# EAGLE design SPv0 (EAGLE 6.5.0)

## Sheet 1 of 2
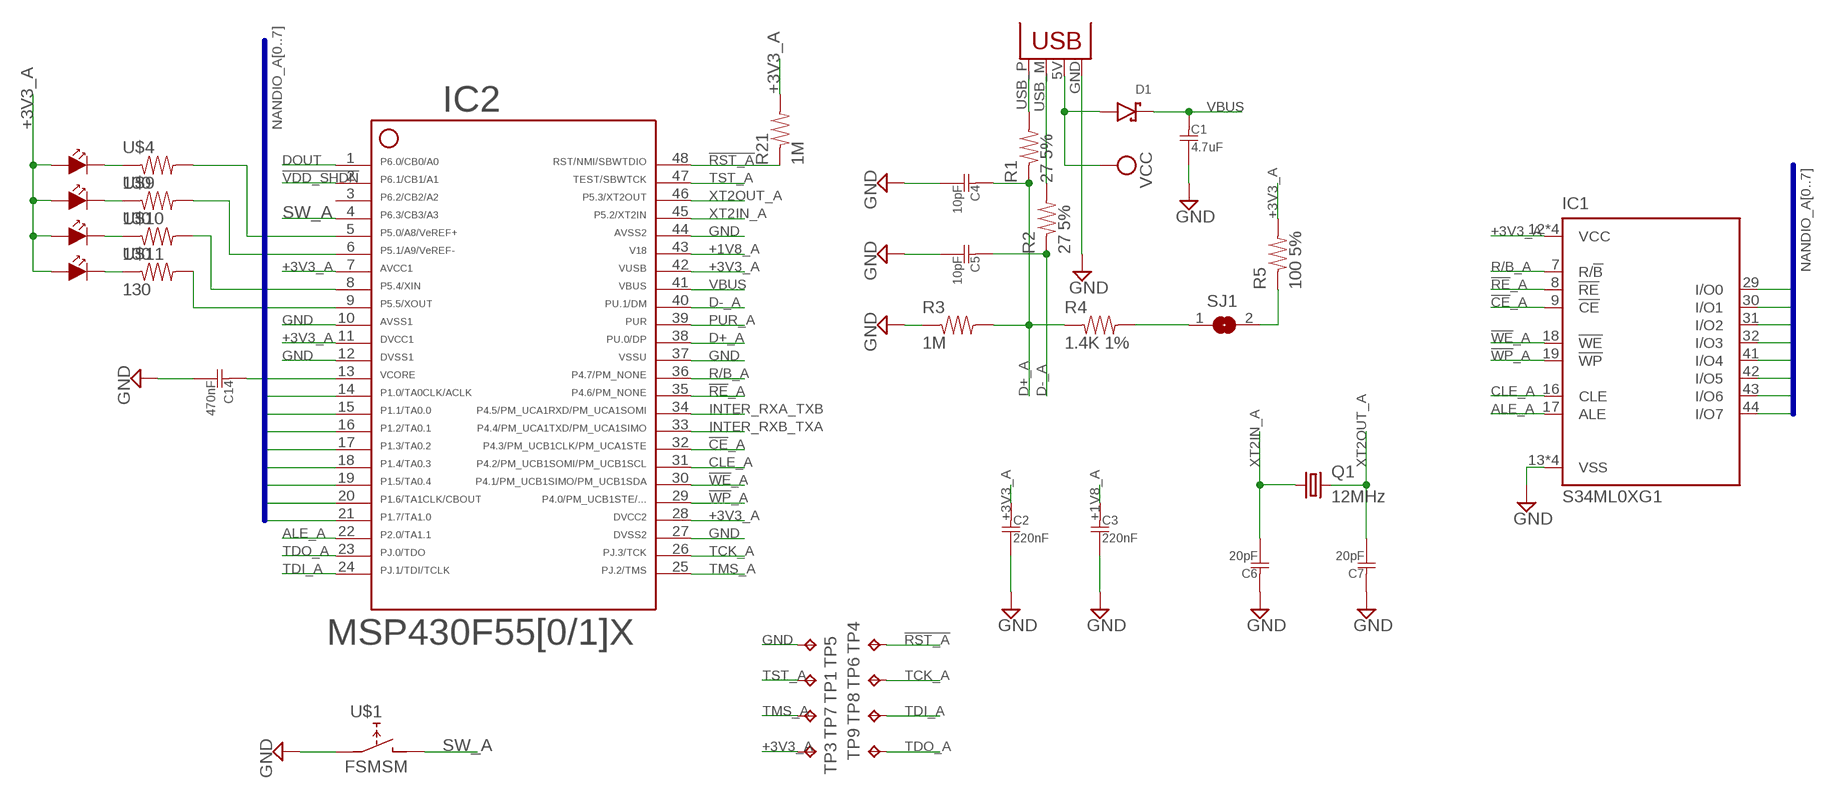
[diagram p0: schematic, sheet 1]

### Parts
C1  4.7uF  C0805  [R0805]
C2  220nF  C0805  [R0805]
C3  220nF  C0805  [R0805]
C4  10pF  C0805  [R0805]
C5  10pF  C0805  [R0805]
C6  20pF  C0805  [R0805]
C7  20pF  C0805  [R0805]
C14  470nF  C0805  [R0805]
D1  D-SCHOTTKY  [SOD123]
IC1  S34ML0XG1  [TSOP48]
IC2  F55[0/1]X---PT48  [PT48]
JP1  USBPCB  [USB-A-PCB]
Q1  12MHz  CRYSTALCSM-3X  [CSM-3X]
R1  27 5%  R0805  [R0805]
R2  27 5%  R0805  [R0805]
R3  1M  R0805  [R0805]
R4  1.4K 1%  R0805  [R0805]
R5  100 5%  R0805  [R0805]
R21  1M  R0805  [R0805]
SJ1  SJW  [SJW]
TP1  TPTP08SQ  [TP08SQ]
TP3  TPTP08SQ  [TP08SQ]
TP4  TPTP08SQ  [TP08SQ]
TP5  TPTP08SQ  [TP08SQ]
TP6  TPTP08SQ  [TP08SQ]
TP7  TPTP08SQ  [TP08SQ]
TP8  TPTP08SQ  [TP08SQ]
TP9  TPTP08SQ  [TP08SQ]
U$1  FSMSM  [FSMSM]
U$4  130  R0805  [R0805]
U$5  LED  [LED0805]
U$6  LED  [LED0805]
U$7  LED  [LED0805]
U$8  LED  [LED0805]
U$9  130  R0805  [R0805]
U$10  130  R0805  [R0805]
U$11  130  R0805  [R0805]

### Nets
!CE!_A: IC1.9(!CE) IC2.32
!RE!_A: IC1.8(!RE) IC2.35
!RST_A!: IC2.48 R21.P$1 TP4.TP
!VDD_SHDN!: IC2.2
!WE!_A: IC1.18(!WE) IC2.30
!WP!_A: IC1.19(!WP) IC2.29
+1V8_A: C3.P$1 IC2.43
+3V3_A: C2.P$1 IC1.12(VCC) IC1.34(VCC) IC1.37(VCC) IC1.39(VCC) IC2.7 IC2.11 IC2.28 IC2.42 R5.P$2 R21.P$2 TP3.TP U$5.ANODE U$6.ANODE U$7.ANODE U$8.ANODE
ALE_A: IC1.17(ALE) IC2.22
CLE_A: IC1.16(CLE) IC2.31
D+_A: C4.P$1 IC2.38 R1.P$1 R3.P$2 R4.P$1
D-_A: C5.P$1 IC2.40 R2.P$1
DOUT: IC2.1 ; also sheet 2
GND: C1.P$2 C2.P$2 C3.P$2 C4.P$2 C5.P$2 C6.P$1 C7.P$1 C14.P$2 IC1.13(VSS) IC1.25(VSS) IC1.36(VSS) IC1.48(VSS) IC2.10 IC2.12 IC2.27 IC2.37 IC2.44 JP1.GND R3.P$1 TP5.TP U$1.P$1(A1) ; also sheet 2
INTER_RXA_TXB: IC2.34
INTER_RXB_TXA: IC2.33
N$1: JP1.USB_P(D+) R1.P$2
N$2: JP1.USB_M(D-) R2.P$2
N$3: C14.P$1 IC2.13
N$4: R5.P$1 SJ1.2
N$11: R4.P$2 SJ1.1
N$19: IC2.9 U$11.P$2
N$22: U$7.CATHODE U$10.P$1
N$23: U$6.CATHODE U$9.P$1
N$24: U$4.P$1 U$5.CATHODE
N$25: U$8.CATHODE U$11.P$1
N$26: IC2.8 U$10.P$2
N$27: IC2.6 U$9.P$2
N$28: IC2.5 U$4.P$2
NANDIO_A0: IC1.29(I/O0) IC2.14
NANDIO_A1: IC1.30(I/O1) IC2.15
NANDIO_A2: IC1.31(I/O2) IC2.16
NANDIO_A3: IC1.32(I/O3) IC2.17
NANDIO_A4: IC1.41(I/O4) IC2.18
NANDIO_A5: IC1.42(I/O5) IC2.19
NANDIO_A6: IC1.43(I/O6) IC2.20
NANDIO_A7: IC1.44(I/O7) IC2.21
PUR_A: IC2.39
R/B_A: IC1.7(R/!B) IC2.36
SW_A: IC2.4 U$1.P$2(B)
TCK_A: IC2.26 TP6.TP
TDI_A: IC2.24 TP8.TP
TDO_A: IC2.23 TP9.TP
TMS_A: IC2.25 TP7.TP
TST_A: IC2.47 TP1.TP
VBUS: C1.P$1 D1.CATHODE IC2.41
VCC: D1.ANODE JP1.5V(VBUS) ; also sheet 2
XT2IN_A: C6.P$2 IC2.45 Q1.P$1
XT2OUT_A: C7.P$2 IC2.46 Q1.P$2
Unconnected: IC2.3

### Buses
NANDIO_A[0..7]

## Sheet 2 of 2
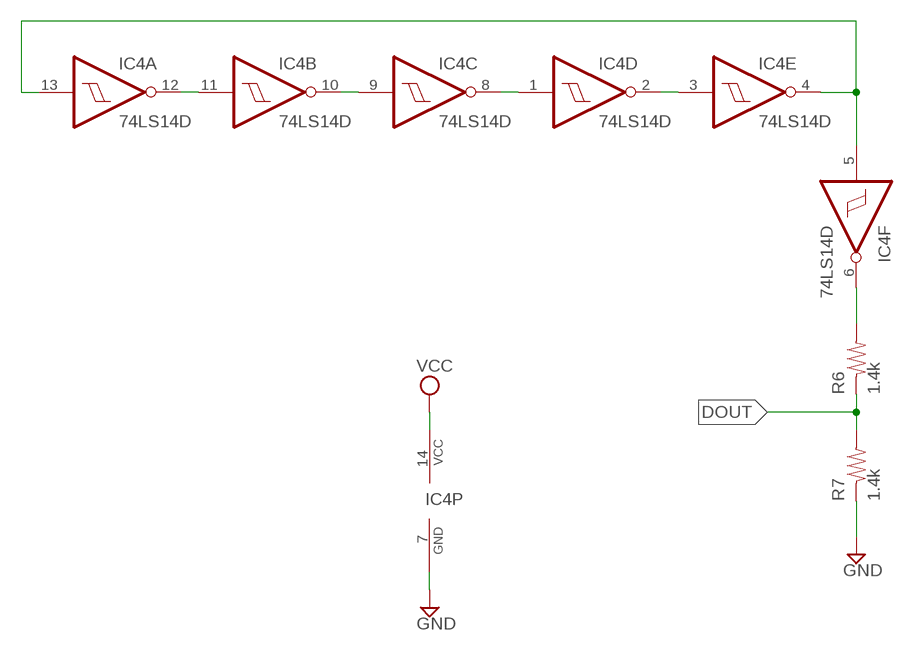
[diagram p1: schematic, sheet 2]

### Parts
IC4  74LS14D  [SO14]
R6  1.4k  R0805  [R0805]
R7  1.4k  R0805  [R0805]

### Nets
DOUT: R6.P$1 R7.P$2 ; also sheet 1
GND: IC4.7(P:GND) R7.P$1 ; also sheet 1
N$5: IC4.11(B:I) IC4.12(A:O)
N$6: IC4.9(C:I) IC4.10(B:O)
N$7: IC4.1(D:I) IC4.8(C:O)
N$8: IC4.2(D:O) IC4.3(E:I)
N$9: IC4.4(E:O) IC4.5(F:I) IC4.13(A:I)
N$10: IC4.6(F:O) R6.P$2
VCC: IC4.14(P:VCC) ; also sheet 1

## Library data of the parts
C1-C7 C14 = Passives:C
D1 = Passives:D-SCHOTTKY
IC1 = Flash:S34ML0XG1: Spansion 1GB, 2GB, and 4GB x8 NAND Flash Memory In x8 I/O mode
IC2 = TI_MSP430_v16:F55[0/1]X---PT48: ***F55[0/1/2]X*** PT48 Rev. 1.0 06/2010 "http://www.ti.com/lit/gpn/msp430f5509" Only for FF5504, F5508,F5509,F5510
IC4 = 74xx-us:74*14: Hex schmitt trigger INVERTER
JP1 = SparkFun-Connectors:USB: USB Connectors USB-B-PTH is fully proven SKU : PRT-00139/CONN-08278 USB-miniB is fully proven SKU : PRT-00587 USB-A-PCB is untested. USB-A-H is throughly reviewed, but untested. Spark Fun Electronics SKU : PRT-00437 USB-B-SMT is throughly reviewed, but untested. Needs silkscreen touching up. USB-A-S has not been used/tested USB-MB-H has not been used/tested USB-MICROB has been used. CONN-09505
Q1 = Passives:CRYSTAL: CRYSTAL
R1-R7 R21 U$4 U$9-U$11 = Passives:R: A standard resistor.
SJ1 = jumper:SJ: SMD solder JUMPER
TP1 TP3-TP9 = testpad:TP: Test pad
U$1 = Passives:FSMSM
U$5-U$8 = Passives:LED

## Board
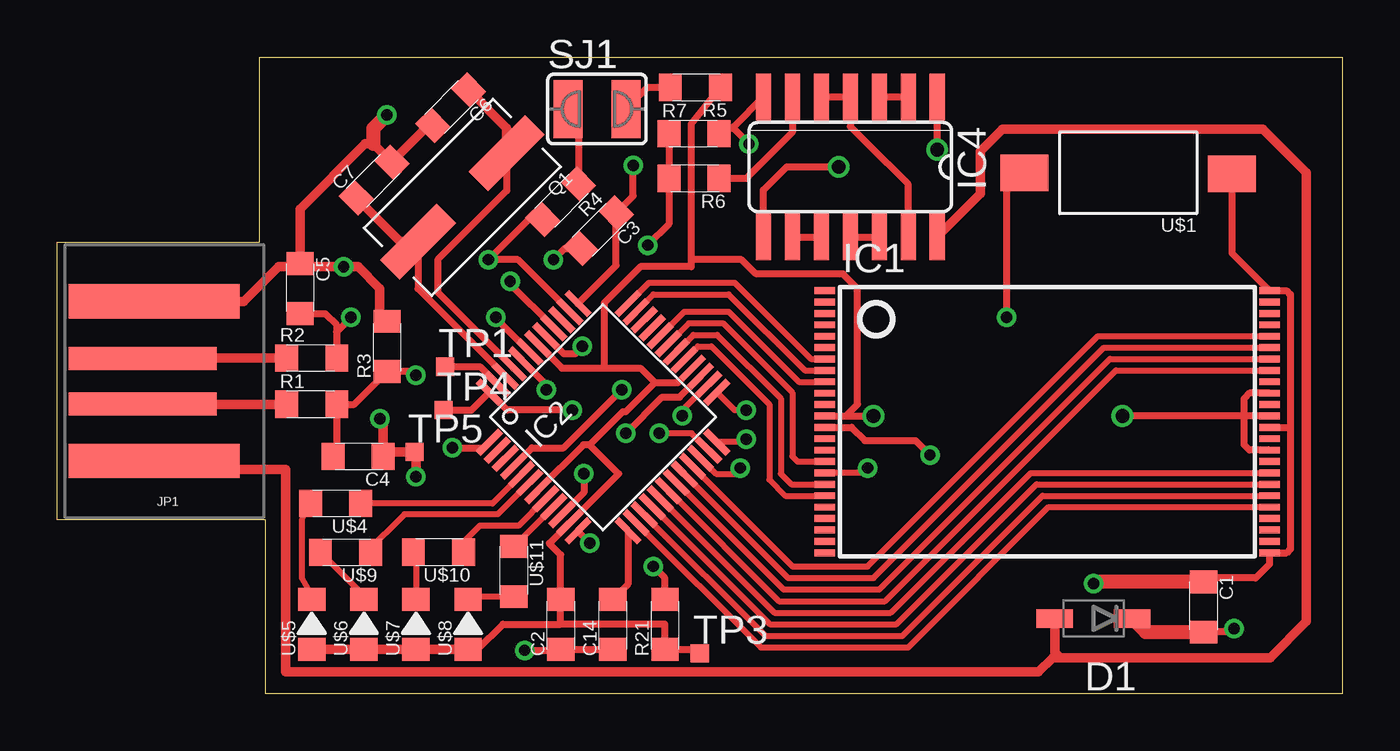
[diagram p2: board, top side]
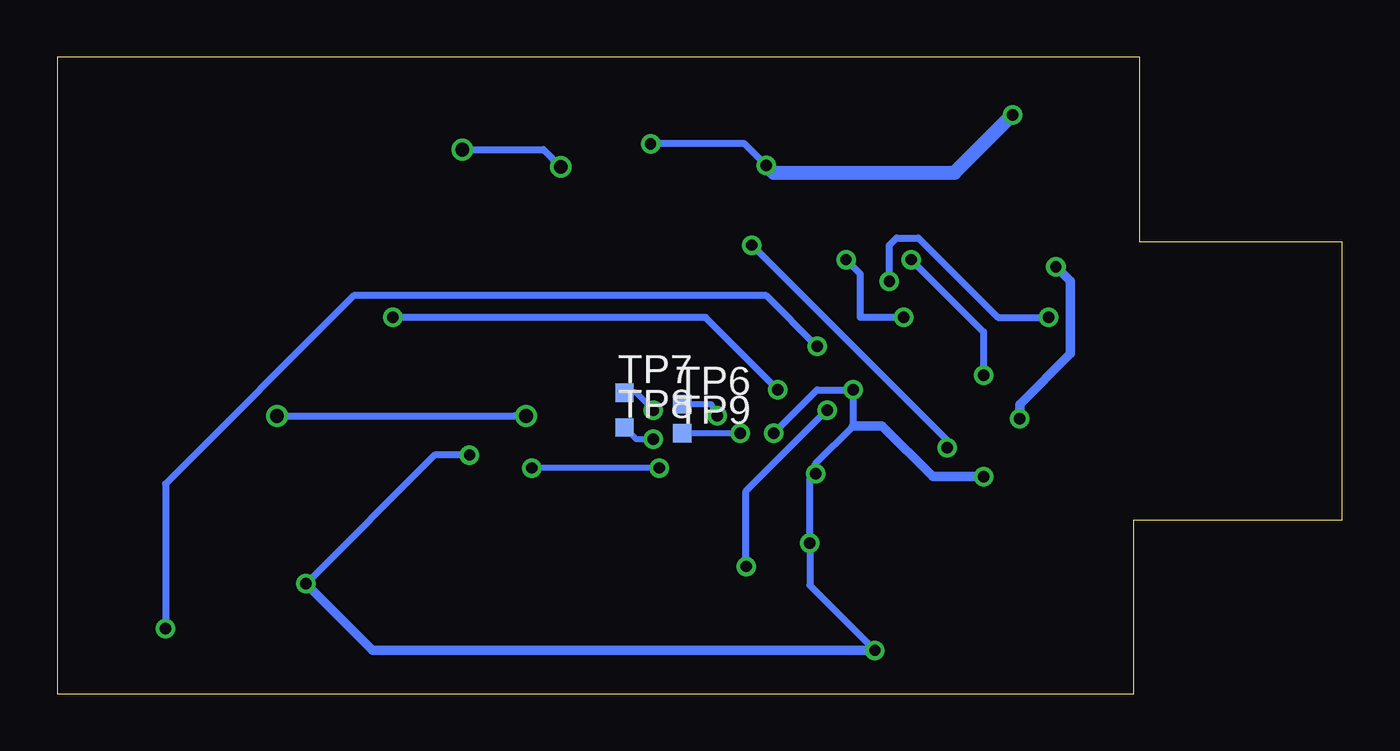
[diagram p3: board, bottom side, seen from below]

Size 56.39 x 27.94 mm. Coordinates in mm from the lower left corner, seen from the top.
Outline: 8.89,19.81 8.89,27.94 56.39,27.94 56.39,0 9.14,0 9.14,7.62 0,7.62 0,19.81 8.89,19.81
Copper layers (1*16): Top 0.0356mm / dielectric 1.5011mm / Bottom 0.0356mm
Design rules "LaenPCBOrder": minimum track width 6mil, minimum drill 13mil, track to track 6mil, track to pad 6mil, pad to pad 6mil, via to via 6mil, smd to smd 6mil, copper to edge 15mil, drill to drill 6mil, minimum pad ring 7mil, minimum via ring 7mil, stop-mask expansion 3mil, vias tented up to drill 0mil, thermal gap 10mil

### Footprints (pad centres in the part's own frame; a part is rotated, then mirrored left to right if it is on the bottom)
R0805 = smd 1 x 1.2: P$1 1.1,0; P$2 -1.1,0
SOD123 = smd 1.6 x 0.8: ANODE 1.7,0; CATHODE -1.7,0
TSOP48 = smd 0.9 x 0.3: 1 -9.75,5.75; 2 -9.75,5.25; 3 -9.75,4.75; 4 -9.75,4.25; 5 -9.75,3.75; 6 -9.75,3.25; 7 -9.75,2.75; 8 -9.75,2.25; 9 -9.75,1.75; 10 -9.75,1.25; 11 -9.75,0.75; 12 -9.75,0.25; 13 -9.75,-0.25; 14 -9.75,-0.75; 15 -9.75,-1.25; 16 -9.75,-1.75; 17 -9.75,-2.25; 18 -9.75,-2.75; 19 -9.75,-3.25; 20 -9.75,-3.75; 21 -9.75,-4.25; 22 -9.75,-4.75; 23 -9.75,-5.25; 24 -9.75,-5.75; 25 9.75,-5.75; 26 9.75,-5.25; 27 9.75,-4.75; 28 9.75,-4.25; 29 9.75,-3.75; 30 9.75,-3.25; 31 9.75,-2.75; 32 9.75,-2.25; 33 9.75,-1.75; 34 9.75,-1.25; 35 9.75,-0.75; 36 9.75,-0.25; 37 9.75,0.25; 38 9.75,0.75; 39 9.75,1.25; 40 9.75,1.75; 41 9.75,2.25; 42 9.75,2.75; 43 9.75,3.25; 44 9.75,3.75; 45 9.75,4.25; 46 9.75,4.75; 47 9.75,5.25; 48 9.75,5.75
PT48 = smd 1.4 x 0.3: 1 -4.3,2.75; 2 -4.3,2.25; 3 -4.3,1.75; 4 -4.3,1.25; 5 -4.3,0.75; 6 -4.3,0.25; 7 -4.3,-0.25; 8 -4.3,-0.75; 9 -4.3,-1.25; 10 -4.3,-1.75; 11 -4.3,-2.25; 12 -4.3,-2.75; 25 4.3,-2.75; 26 4.3,-2.25; 27 4.3,-1.75; 28 4.3,-1.25; 29 4.3,-0.75; 30 4.3,-0.25; 31 4.3,0.25; 32 4.3,0.75; 33 4.3,1.25; 34 4.3,1.75; 35 4.3,2.25; 36 4.3,2.75 | smd 0.3 x 1.4: 13 -2.75,-4.3; 14 -2.25,-4.3; 15 -1.75,-4.3; 16 -1.25,-4.3; 17 -0.75,-4.3; 18 -0.25,-4.3; 19 0.25,-4.3; 20 0.75,-4.3; 21 1.25,-4.3; 22 1.75,-4.3; 23 2.25,-4.3; 24 2.75,-4.3; 37 2.75,4.3; 38 2.25,4.3; 39 1.75,4.3; 40 1.25,4.3; 41 0.75,4.3; 42 0.25,4.3; 43 -0.25,4.3; 44 -0.75,4.3; 45 -1.25,4.3; 46 -1.75,4.3; 47 -2.25,4.3; 48 -2.75,4.3
SO14 = smd 0.66 x 2.032: 1 -3.81,-3.073; 2 -2.54,-3.073; 3 -1.27,-3.073; 4 0,-3.073; 5 1.27,-3.073; 6 2.54,-3.073; 7 3.81,-3.073; 8 3.81,3.073; 9 2.54,3.073; 10 1.27,3.073; 11 0,3.073; 12 -1.27,3.073; 13 -2.54,3.073; 14 -3.81,3.073
USB-A-PCB = smd 7.5 x 1.5: 5V -0.2,3.5; GND -0.2,-3.5 | smd 6.5 x 1: USB_M 0.3,-1; USB_P 0.3,1
CSM-3X = smd 3.5 x 1.2: P$1 -2.75,0; P$2 2.75,0
SJW = smd 1.27 x 2.54: 1 -1.27,0; 2 1.27,0
TP08SQ = smd 0.8 x 0.8: TP 0,0
FSMSM = smd 2.1 x 1.6: P$1 -4.55,0.05; P$2 4.55,0
LED0805 = smd 1 x 1.2: ANODE -1.1,0; CATHODE 1.1,0

### Placement (x,y rotation side)
C1  50.29,3.81 270 top
C2  22.1,3.05 90 top
C3  23.75,20.32 225 top
C4  13.21,10.41 180 top
C5  10.67,17.78 270 top
C6  17.27,25.72 225 top
C7  13.91,22.54 45 top
C14  24.38,3.05 90 top
D1  45.47,3.3 180 top
IC1  43.43,11.94 0 top
IC2  23.95,12.14 45 top
IC4  34.8,23.11 180 top
JP1  4.06,13.72 180 top
Q1  17.78,21.78 225 top
R1  11.18,12.7 0 top
R2  11.18,14.73 0 top
R3  14.48,15.24 90 top
R4  22.1,21.59 225 top
R5  28,26.61 180 top
R6  27.94,22.61 180 top
R7  27.94,24.57 0 top
R21  26.67,3.05 90 top
SJ1  23.69,25.65 0 top
TP1  17.02,14.35 0 top
TP3  28.19,1.78 0 top
TP4  16.95,12.45 0 top
TP5  15.68,10.6 0 top
TP6  28.96,12.7 0 bottom
TP7  31.5,13.21 0 bottom
TP8  31.5,11.68 0 bottom
TP9  28.96,11.43 0 bottom
U$1  46.99,22.86 180 top
U$4  12.22,8.35 180 top
U$5  11.18,3.05 90 top
U$6  13.46,3.05 90 top
U$7  15.75,3.05 90 top
U$8  18.03,3.05 90 top
U$9  12.66,6.2 180 top
U$10  16.73,6.21 180 top
U$11  20.04,5.36 270 top

### Tracks (layer width: path | path; a pad name or v marks a point on that pad's centre or on a via)
!CE!_A
  Top 0.254: IC2.32 27.52,16.76 29.46,16.76 32.54,13.69 IC1.9
!RE!_A
  Top 0.254: IC2.35 26.16,17.53 29.46,17.53 32.8,14.19 IC1.8
!RST_A!  (via drill 0.5)
  Top 0.305: R21.P$1 26.67,5.08 v26.16,5.59 | TP4.TP 18.03,12.45 18.18,12.45 IC2.48 19.75,12.45 v22.61,12.45
  Bottom 0.305: v26.16,5.59 26.16,8.89 v22.61,12.45
!WE!_A
  Top 0.254: IC2.30 27.92,15.75 28.96,15.75 31.75,12.95 31.75,9.65 32.21,9.19 IC1.18
!WP!_A
  Top 0.254: IC2.29 28.11,15.24 28.7,15.24 31.24,12.7 31.24,9.4 31.95,8.69 IC1.19
+1V8_A  (via drill 0.5)
  Top 0.305: IC2.43 19.24,16.49 v19.24,16.51 | v21.78,19.05 22.27,19.54 C3.P$1
  Bottom 0.305: v19.24,16.51 21.14,16.51 21.14,18.41 v21.78,19.05
+3V3_A  (via drill 0.6)
  Top 0.305: IC1.39 52.3,13.19 52.07,12.95 52.07,12.19 | IC1.34 52.3,10.69 52.07,10.92 52.07,12.19 | IC1.37 52.07,12.19 | 52.07,12.19 | 52.07,12.19 v46.74,12.19 | v35.81,12.19 IC1.12 34.6,12.19 35.12,12.7 35.12,17.78 34.48,18.41 30.67,18.41 30.04,19.05 27.81,19.05 | 22.1,3.05 26.67,3.05 R21.P$2 28.02,1.95 TP3.TP | 22.1,3.05 C2.P$1 22.1,6.1 21.59,6.6 21.6,6.6 IC2.11 22.5,7.52 24.64,9.65 23.37,10.92 | U$8.ANODE 18.46,1.95 19.56,3.05 22.1,3.05 | 23.37,10.92 23.09,10.92 IC2.7 | IC2.42 22.15,14.29 24,14.29 | 24,14.29 25.59,14.29 26.23,13.65 | 26.23,13.65 27.23,13.65 IC2.28 | R5.P$2 27.81,25 27.81,19.05 | 27.81,19.05 27.81,18.73 25.59,18.73 24,17.15 24,14.29 | 23.37,10.92 24.83,12.38 24.96,12.38 26.23,13.65
  Top 0.406: U$5.ANODE U$6.ANODE U$7.ANODE U$8.ANODE
  Bottom 0.305: v46.74,12.19 36.32,12.19 | 36.32,12.19 v35.81,12.19 36.32,12.19
ALE_A  (via drill 0.5)
  Top 0.254: IC2.22 28.91,9.65 29.72,9.65 v29.97,9.91 | v35.56,9.91 35.34,9.69 IC1.17
  Bottom 0.254: v29.97,9.91 v35.56,9.91
CLE_A
  Top 0.254: IC2.31 27.72,16.26 29.21,16.26 32.26,13.21 32.26,10.41 32.48,10.19 IC1.16
D+_A  (via drill 0.5)
  Top 0.305: C4.P$1 12.28,10.58 R1.P$1 13.04,12.7 R3.P$2 15.58,14.14 v15.75,13.97 | IC2.38 20.22,19.05 v18.92,19.05 20.68,20.81 R4.P$1
  Bottom 0.305: v18.92,19.05 15.75,15.88 v15.75,13.97
D-_A  (via drill 0.5)
  Top 0.305: C5.P$1 11.77,16.68 12.26,16.19 12.26,15.88 | 12.26,15.88 12.26,14.75 R2.P$1 | IC2.40 19.88,17.98 v19.88,18.1 | v12.89,16.51 12.26,15.88
  Bottom 0.305: v19.88,18.1 19.88,19.69 19.56,20 18.61,20 15.11,16.51 v12.89,16.51
DOUT  (via drill 0.5)
  Top 0.305: R7.P$2 R6.P$1 26.84,20.62 v25.91,19.69 | v17.34,10.79 18.72,10.79 IC2.1
  Bottom 0.305: v25.91,19.69 17.34,11.11 v17.34,10.79
GND  (via drill 0.5)
  Top 0.305: C1.P$2 50.46,5.08 52.58,5.08 53.18,5.69 IC1.25 53.94,6.19 54.1,6.35 54.1,11.68 | 54.1,11.68 54.1,17.53 53.94,17.69 IC1.48 51.54,19.33 U$1.P$1 | IC1.36 54.1,11.69 54.1,11.68 | R7.P$1 29.69,24.89 | 29.69,24.89 IC4.7 | C14.P$2 C2.P$2 22.05,1.91 v20.51,1.91 | IC2.12 22.85,7.12 v23.37,6.6 | v23.11,9.65 23.11,8.82 IC2.10 | v21.46,13.33 21.46,13.56 IC2.44 | v24.96,11.43 26.54,13.02 27.31,13.02 IC2.27 | IC2.37 24.53,18.79 C3.P$2 25.27,21.84 v25.27,23.18 | v30.35,24.13 29.69,24.79 29.69,24.89 | IC1.13 34.86,11.69 35.43,11.11 37.66,11.11 v38.29,10.48
  Top 0.406: C6.P$1 16.3,24.94 C7.P$1 13.88,24.13 13.53,24.13 10.67,21.27 C5.P$2 | JP1.GND 8.2,17.22 9.71,18.73 10.52,18.73 C5.P$2 | v15.75,9.53 15.75,10.54 TP5.TP 14.5,10.6 C4.P$2 14.31,11.92 v14.16,12.06 | C5.P$2 10.82,18.73 v12.57,18.73 13.21,18.73 14.16,17.78 14.16,16.66 R3.P$1
  Top 0.61: C1.P$2 45.55,4.91 v45.47,4.83 | v14.48,25.4 13.88,24.8 13.88,24.13
  Bottom 0.305: v24.96,11.43 24.64,11.75 23.05,13.33 v21.46,13.33 21.46,11.75 23.11,10.1 v23.11,9.65 23.37,9.4 v23.37,6.6 23.37,4.76 v20.51,1.91 | v25.27,23.18 26.23,24.13 v30.35,24.13 | v38.29,10.48 39.81,10.48 v45.47,4.83
  Bottom 0.406: v15.75,9.53 17.97,9.53 20.19,11.75 21.46,11.75 | v12.57,18.73 11.94,18.1 11.94,14.92 14.16,12.7 v14.16,12.06 | v45.47,4.83 42.55,1.91 v20.51,1.91
  Bottom 0.61: v25.27,23.18 24.96,22.86 17.02,22.86 v14.48,25.4
N$1
  Top 0.406: JP1.USB_P 3.78,12.7 R1.P$2
N$2
  Top 0.406: JP1.USB_M 3.78,14.73 R2.P$2
N$3
  Top 0.305: IC2.13 25.05,4.81 C14.P$1
N$4
  Top 0.305: SJ1.2 25.91,26.61 R5.P$1
N$5
  Top 0.305: IC4.11 IC4.12
N$6
  Top 0.305: IC4.9 IC4.10
N$7  (via drill 0.6)
  Top 0.305: IC4.1 v38.61,23.88 | v34.29,23.11 32,23.11 31.24,22.35 30.99,22.1 IC4.8
  Bottom 0.305: v38.61,23.88 35.05,23.88 v34.29,23.11
N$8
  Top 0.305: IC4.3 IC4.2
N$9
  Top 0.305: IC4.5 IC4.4 34.8,24.89 35.56,24.13 37.34,22.35 IC4.13
N$10
  Top 0.305: IC4.6 32.26,24.64 30.23,22.61 R6.P$2
N$11
  Top 0.305: SJ1.1 22.88,25.19 R4.P$2
N$19
  Top 0.254: IC2.9 U$11.P$2
N$22
  Top 0.254: U$10.P$1 15.75,6.1 U$7.CATHODE
N$23
  Top 0.254: U$9.P$1 13.46,4.3 U$6.CATHODE
N$24
  Top 0.254: U$4.P$1 10.73,7.64 10.73,5.08 11.18,4.32 U$5.CATHODE
N$25
  Top 0.254: U$8.CATHODE 18.15,4.27 U$11.P$1
N$26
  Top 0.254: IC2.8 20.24,7.37 18.54,7.37 17.83,6.66 U$10.P$2
N$27
  Top 0.254: IC2.6 19.34,7.87 15.24,7.87 13.57,6.2 U$9.P$2
N$28
  Top 0.254: IC2.5 19.11,8.35 U$4.P$2
NANDIO_A0
  Top 0.254: IC2.14 30.87,2.03 37.34,2.03 43.49,8.19 IC1.29
NANDIO_A1
  Top 0.254: IC2.15 31.07,2.54 37.08,2.54 43.23,8.69 IC1.30
NANDIO_A2
  Top 0.254: IC2.16 31.27,3.05 36.83,3.05 42.97,9.19 IC1.31
NANDIO_A3
  Top 0.254: IC2.17 31.47,3.56 36.58,3.56 42.71,9.69 IC1.32
NANDIO_A4
  Top 0.254: IC2.18 31.67,4.06 36.32,4.06 46.45,14.19 IC1.41
NANDIO_A5
  Top 0.254: IC2.19 31.87,4.57 36.07,4.57 46.18,14.69 IC1.42
NANDIO_A6
  Top 0.254: IC2.20 32.07,5.08 35.81,5.08 45.92,15.19 IC1.43
NANDIO_A7
  Top 0.254: IC2.21 32.27,5.59 35.56,5.59 45.66,15.69 IC1.44
R/B_A
  Top 0.254: IC2.36 25.96,18.03 29.72,18.03 33.06,14.69 IC1.7
SW_A  (via drill 0.5)
  Top 0.305: IC2.4 20.03,9.99 20.83,10.79 22.22,10.79 v24.77,13.33 | v41.66,16.51 41.66,22.08 U$1.P$2
  Bottom 0.305: v24.77,13.33 27.94,16.51 v41.66,16.51
TCK_A  (via drill 0.5)
  Top 0.254: IC2.26 27.44,12.45 v27.43,12.19
  Bottom 0.254: v27.43,12.19 27.69,12.7 TP6.TP
TDI_A  (via drill 0.5)
  Top 0.254: v30.23,11.18 30.09,11.04 IC2.24
  Bottom 0.254: TP8.TP 30.99,11.18 v30.23,11.18
TDO_A  (via drill 0.5)
  Top 0.254: IC2.23 27.84,11.43 v26.42,11.43
  Bottom 0.254: v26.42,11.43 TP9.TP
TMS_A  (via drill 0.5)
  Top 0.254: IC2.25 29.72,12.45 v30.23,12.45
  Bottom 0.254: v30.23,12.45 30.99,13.21 TP7.TP
TST_A
  Top 0.305: TP1.TP 18.55,14.35 IC2.47
VBUS  (via drill 0.5)
  Top 0.305: IC2.41 22.22,14.92 22.73,14.92 v23.05,15.24 | v51.62,2.86 51.48,2.71 C1.P$1
  Top 0.61: D1.CATHODE 47.76,2.71 C1.P$1
  Bottom 0.305: v23.05,15.24 25.27,17.46 43.37,17.46 51.62,9.21 v51.62,2.86
VCC
  Top 0.406: IC4.14 40.51,21.95 40.51,23.81 41.47,24.77 52.9,24.77 54.8,22.86 54.8,3.18 53.21,1.59 44.01,1.59 | 44.01,1.59 43.77,1.83 D1.ANODE | JP1.5V 4.64,9.84 10.03,9.84 10.03,0.95 43.05,0.95 43.69,1.59 44.01,1.59
XT2IN_A
  Top 0.305: Q1.P$1 19.72,22.07 16.7,19.05 16.7,17.62 IC2.45
  Top 0.406: C6.P$2 19.72,24.82 Q1.P$1
XT2OUT_A
  Top 0.305: Q1.P$2 15.84,17.78 IC2.46
  Top 0.406: C7.P$2 15.06,19.84 Q1.P$2